# EAGLE board mt15_pla (EAGLE 6.6.0), part 1 of 4
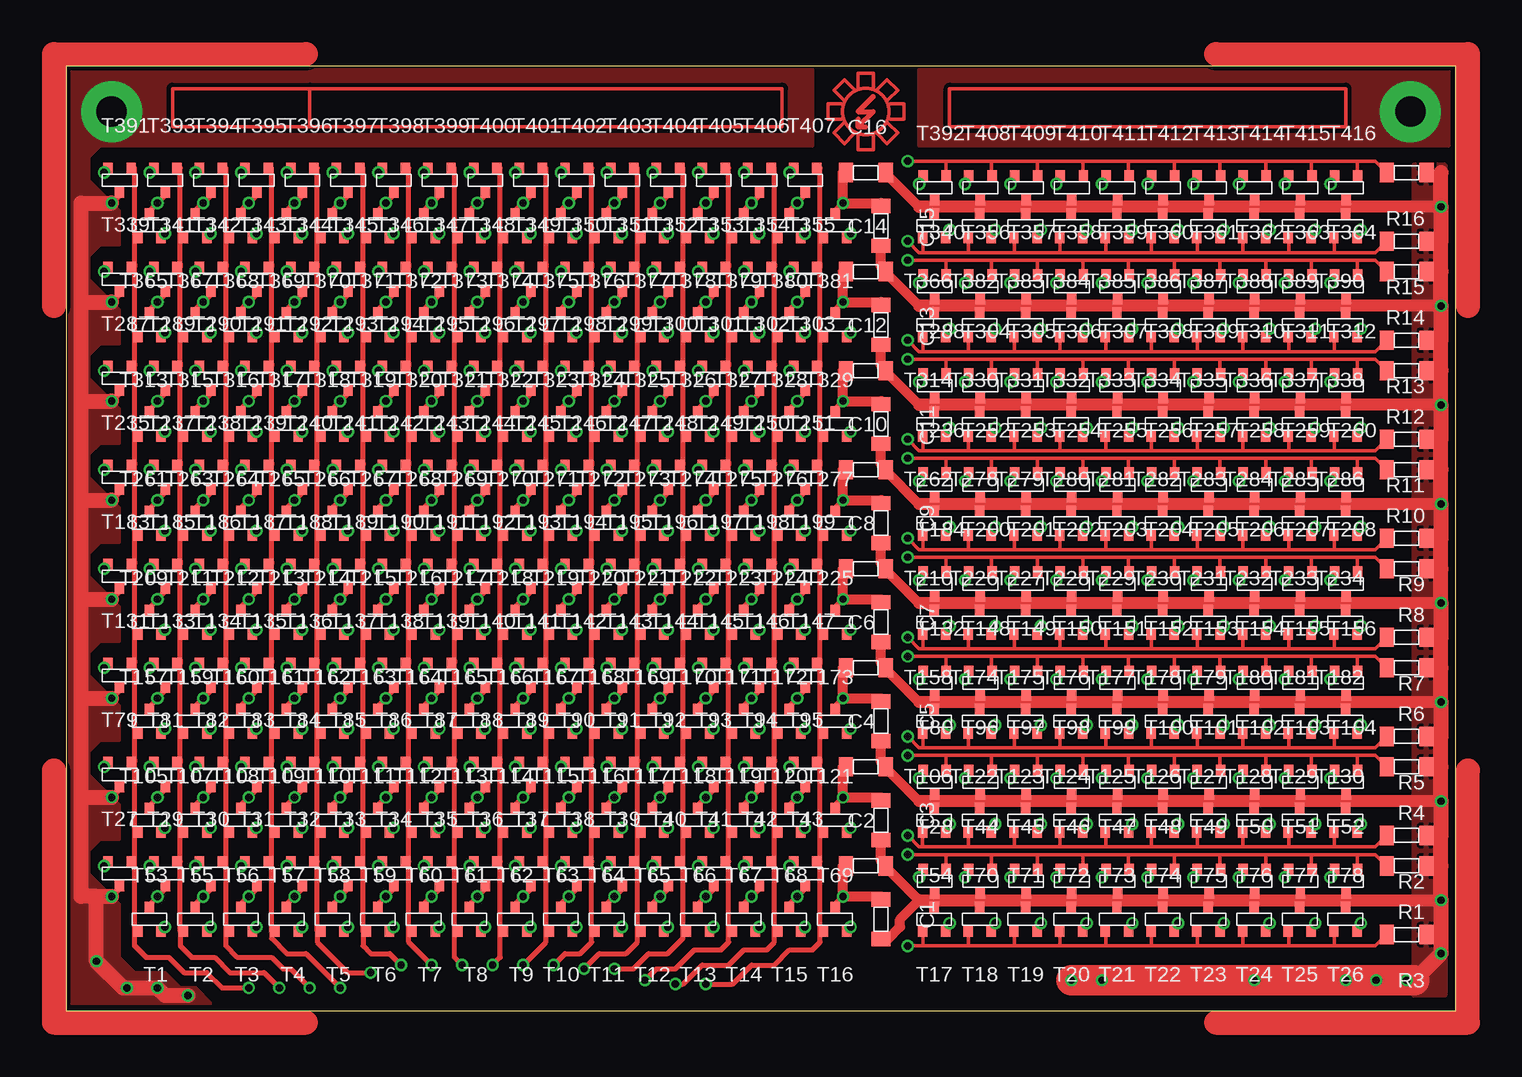
[diagram p9: board, top side]
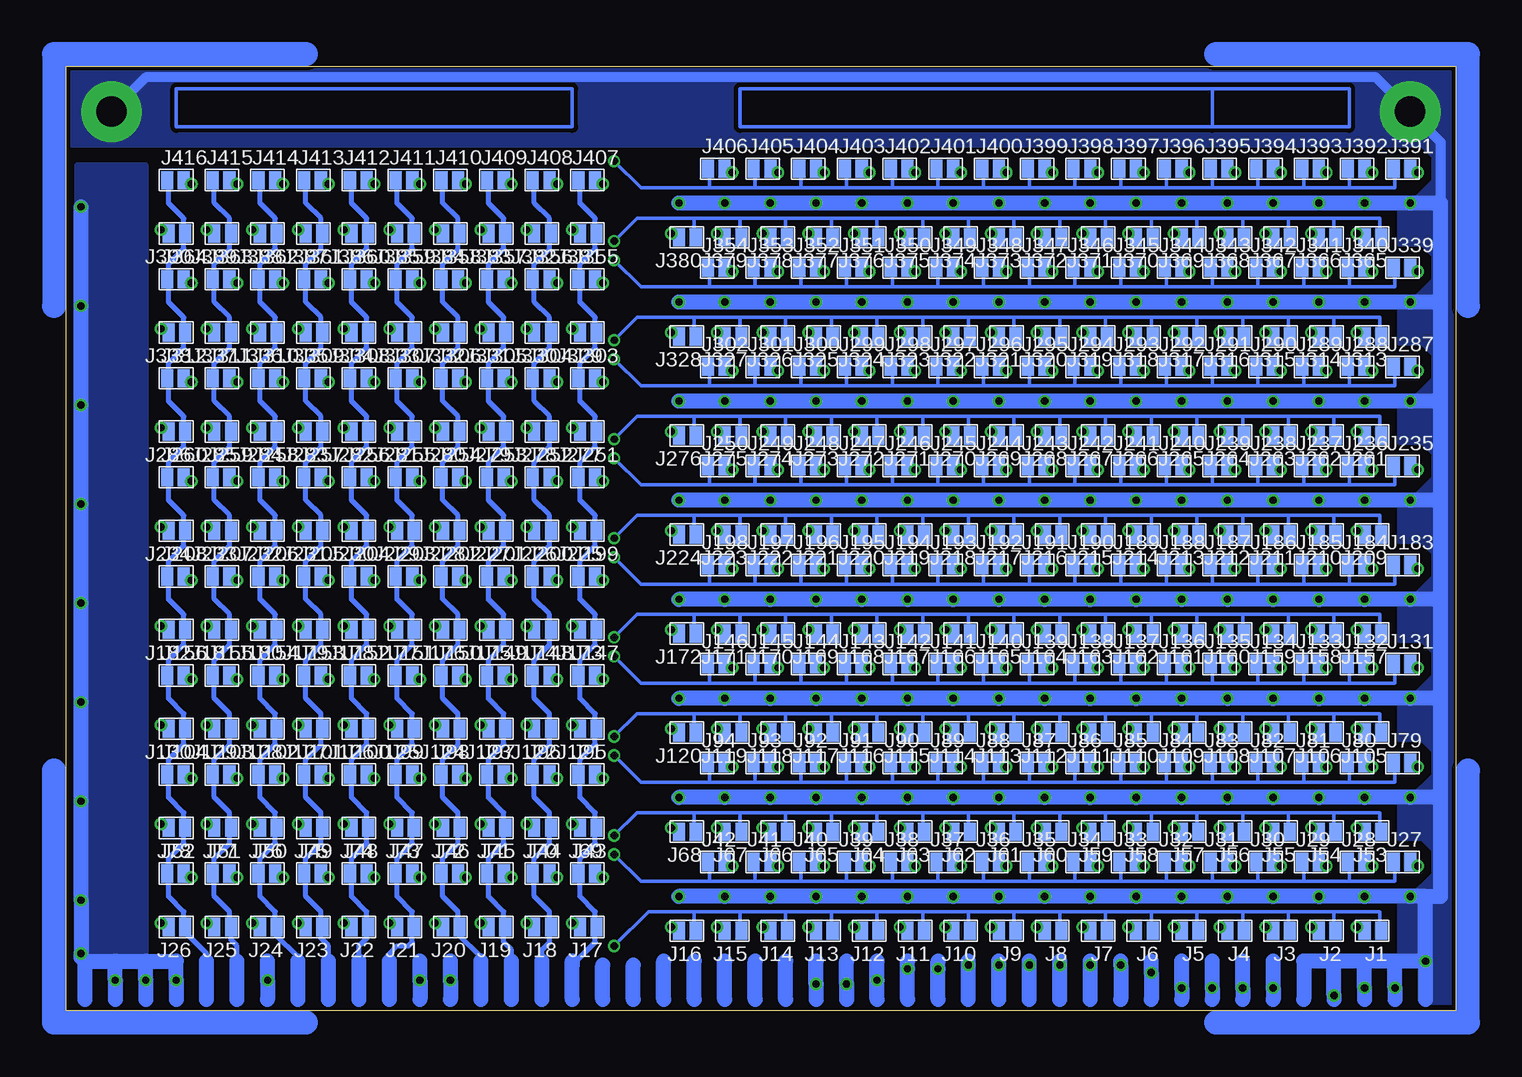
[diagram p10: board, bottom side, seen from below]

Size 115.87 x 78.73 mm. Coordinates in mm from the lower left corner, seen from the top.
Outline: 0,0 115.87,0 115.87,78.73 0,78.73 0,0
Copper layers (1*16): Top 0.035mm / dielectric 1.5mm / Bottom 0.035mm
Design rules "default *": minimum track width 10mil, minimum drill 0.6mm, track to track 8mil, track to pad 8mil, pad to pad 8mil, via to via 8mil, smd to smd 8mil, copper to edge 0mil, drill to drill 8mil, minimum pad ring 10mil, minimum via ring 8mil, stop-mask expansion 4mil, vias tented up to drill 0mil, thermal gap 10mil

## Footprints (pad centres in the part's own frame; a part is rotated, then mirrored left to right if it is on the bottom)
0204 = smd 1.194 x 1.6: 1 -1.651,0; 2 1.651,0
JUMPII = smd 1.016 x 1.524: 1 -0.762,0; 2 0.635,0
SOT-23 = smd 0.787 x 0.889: 1 -0.94,1.016; 2 0.991,1.016; 3 0.025,-1.016

## Placement (x,y rotation side)
C1  100n  [0204]  67.94,7.62 270 top
C2  100n  [0204]  66.67,12.06 0 top
C3  100n  [0204]  67.94,15.88 270 top
C4  100n  [0204]  66.67,20.32 0 top
C5  100n  [0204]  67.94,24.13 270 top
C6  100n  [0204]  66.67,28.57 0 top
C7  100n  [0204]  67.94,32.38 270 top
C8  100n  [0204]  66.67,36.83 0 top
C9  100n  [0204]  67.94,40.64 270 top
C10  100n  [0204]  66.67,45.09 0 top
C11  100n  [0204]  67.94,48.9 270 top
C12  100n  [0204]  66.67,53.34 0 top
C13  100n  [0204]  67.94,57.15 270 top
C14  100n  [0204]  66.67,61.59 0 top
C15  100n  [0204]  67.94,65.41 270 top
C16  100n  [0204]  66.67,69.85 0 top
J1  JUMPII  [JUMPII]  6.99,6.67 180 bottom
J2  JUMPII  [JUMPII]  10.79,6.67 180 bottom
J3  JUMPII  [JUMPII]  14.61,6.67 180 bottom
J4  JUMPII  [JUMPII]  18.41,6.67 180 bottom
J5  JUMPII  [JUMPII]  22.23,6.67 180 bottom
J6  JUMPII  [JUMPII]  26.04,6.67 180 bottom
J7  JUMPII  [JUMPII]  29.84,6.67 180 bottom
J8  JUMPII  [JUMPII]  33.66,6.67 180 bottom
J9  JUMPII  [JUMPII]  37.47,6.67 180 bottom
J10  JUMPII  [JUMPII]  41.27,6.67 180 bottom
J11  JUMPII  [JUMPII]  45.09,6.67 180 bottom
J12  JUMPII  [JUMPII]  48.9,6.67 180 bottom
J13  JUMPII  [JUMPII]  52.7,6.67 180 bottom
J14  JUMPII  [JUMPII]  56.52,6.67 180 bottom
J15  JUMPII  [JUMPII]  60.33,6.67 180 bottom
J16  JUMPII  [JUMPII]  64.14,6.67 180 bottom
J17  JUMPII  [JUMPII]  72.39,6.99 180 bottom
J18  JUMPII  [JUMPII]  76.2,6.99 180 bottom
J19  JUMPII  [JUMPII]  80.01,6.99 180 bottom
J20  JUMPII  [JUMPII]  83.82,6.99 180 bottom
J21  JUMPII  [JUMPII]  87.63,6.99 180 bottom
J22  JUMPII  [JUMPII]  91.44,6.99 180 bottom
J23  JUMPII  [JUMPII]  95.25,6.99 180 bottom
J24  JUMPII  [JUMPII]  99.06,6.99 180 bottom
J25  JUMPII  [JUMPII]  102.87,6.99 180 bottom
J26  JUMPII  [JUMPII]  106.68,6.99 180 bottom
J27  JUMPII  [JUMPII]  4.45,12.38 0 bottom
J28  JUMPII  [JUMPII]  8.26,12.38 0 bottom
J29  JUMPII  [JUMPII]  12.06,12.38 0 bottom
J30  JUMPII  [JUMPII]  15.88,12.38 0 bottom
J31  JUMPII  [JUMPII]  19.68,12.38 0 bottom
J32  JUMPII  [JUMPII]  23.5,12.38 0 bottom
J33  JUMPII  [JUMPII]  27.3,12.38 0 bottom
J34  JUMPII  [JUMPII]  31.11,12.38 0 bottom
J35  JUMPII  [JUMPII]  34.92,12.38 0 bottom
J36  JUMPII  [JUMPII]  38.73,12.38 0 bottom
J37  JUMPII  [JUMPII]  42.55,12.38 0 bottom
J38  JUMPII  [JUMPII]  46.35,12.38 0 bottom
J39  JUMPII  [JUMPII]  50.16,12.38 0 bottom
J40  JUMPII  [JUMPII]  53.98,12.38 0 bottom
J41  JUMPII  [JUMPII]  57.78,12.38 0 bottom
J42  JUMPII  [JUMPII]  61.59,12.38 0 bottom
J43  JUMPII  [JUMPII]  72.39,11.43 0 bottom
J44  JUMPII  [JUMPII]  76.2,11.43 0 bottom
J45  JUMPII  [JUMPII]  80.01,11.43 0 bottom
J46  JUMPII  [JUMPII]  83.82,11.43 0 bottom
J47  JUMPII  [JUMPII]  87.63,11.43 0 bottom
J48  JUMPII  [JUMPII]  91.44,11.43 0 bottom
J49  JUMPII  [JUMPII]  95.25,11.43 0 bottom
J50  JUMPII  [JUMPII]  99.06,11.43 0 bottom
J51  JUMPII  [JUMPII]  102.87,11.43 0 bottom
J52  JUMPII  [JUMPII]  106.68,11.43 0 bottom
J53  JUMPII  [JUMPII]  6.99,14.92 180 bottom
J54  JUMPII  [JUMPII]  10.79,14.92 180 bottom
J55  JUMPII  [JUMPII]  14.61,14.92 180 bottom
J56  JUMPII  [JUMPII]  18.41,14.92 180 bottom
J57  JUMPII  [JUMPII]  22.23,14.92 180 bottom
J58  JUMPII  [JUMPII]  26.04,14.92 180 bottom
J59  JUMPII  [JUMPII]  29.84,14.92 180 bottom
J60  JUMPII  [JUMPII]  33.66,14.92 180 bottom
J61  JUMPII  [JUMPII]  37.47,14.92 180 bottom
J62  JUMPII  [JUMPII]  41.27,14.92 180 bottom
J63  JUMPII  [JUMPII]  45.09,14.92 180 bottom
J64  JUMPII  [JUMPII]  48.9,14.92 180 bottom
J65  JUMPII  [JUMPII]  52.7,14.92 180 bottom
J66  JUMPII  [JUMPII]  56.52,14.92 180 bottom
J67  JUMPII  [JUMPII]  60.33,14.92 180 bottom
J68  JUMPII  [JUMPII]  64.14,14.92 180 bottom
J69  JUMPII  [JUMPII]  72.39,15.24 180 bottom
J70  JUMPII  [JUMPII]  76.2,15.24 180 bottom
J71  JUMPII  [JUMPII]  80.01,15.24 180 bottom
J72  JUMPII  [JUMPII]  83.82,15.24 180 bottom
J73  JUMPII  [JUMPII]  87.63,15.24 180 bottom
J74  JUMPII  [JUMPII]  91.44,15.24 180 bottom
J75  JUMPII  [JUMPII]  95.25,15.24 180 bottom
J76  JUMPII  [JUMPII]  99.06,15.24 180 bottom
J77  JUMPII  [JUMPII]  102.87,15.24 180 bottom
J78  JUMPII  [JUMPII]  106.68,15.24 180 bottom
J79  JUMPII  [JUMPII]  4.45,20.64 0 bottom
J80  JUMPII  [JUMPII]  8.26,20.64 0 bottom
J81  JUMPII  [JUMPII]  12.06,20.64 0 bottom
J82  JUMPII  [JUMPII]  15.88,20.64 0 bottom
J83  JUMPII  [JUMPII]  19.68,20.64 0 bottom
J84  JUMPII  [JUMPII]  23.5,20.64 0 bottom
J85  JUMPII  [JUMPII]  27.3,20.64 0 bottom
J86  JUMPII  [JUMPII]  31.11,20.64 0 bottom
J87  JUMPII  [JUMPII]  34.92,20.64 0 bottom
J88  JUMPII  [JUMPII]  38.73,20.64 0 bottom
J89  JUMPII  [JUMPII]  42.55,20.64 0 bottom
J90  JUMPII  [JUMPII]  46.35,20.64 0 bottom
J91  JUMPII  [JUMPII]  50.16,20.64 0 bottom
J92  JUMPII  [JUMPII]  53.98,20.64 0 bottom
J93  JUMPII  [JUMPII]  57.78,20.64 0 bottom
J94  JUMPII  [JUMPII]  61.59,20.64 0 bottom
J95  JUMPII  [JUMPII]  72.39,19.68 0 bottom
J96  JUMPII  [JUMPII]  76.2,19.68 0 bottom
J97  JUMPII  [JUMPII]  80.01,19.68 0 bottom
J98  JUMPII  [JUMPII]  83.82,19.68 0 bottom
J99  JUMPII  [JUMPII]  87.63,19.68 0 bottom
J100  JUMPII  [JUMPII]  91.44,19.68 0 bottom
J101  JUMPII  [JUMPII]  95.25,19.68 0 bottom
J102  JUMPII  [JUMPII]  99.06,19.68 0 bottom
J103  JUMPII  [JUMPII]  102.87,19.68 0 bottom
J104  JUMPII  [JUMPII]  106.68,19.68 0 bottom
J105  JUMPII  [JUMPII]  6.99,23.18 180 bottom
J106  JUMPII  [JUMPII]  10.79,23.18 180 bottom
J107  JUMPII  [JUMPII]  14.61,23.18 180 bottom
J108  JUMPII  [JUMPII]  18.41,23.18 180 bottom
J109  JUMPII  [JUMPII]  22.23,23.18 180 bottom
J110  JUMPII  [JUMPII]  26.04,23.18 180 bottom
J111  JUMPII  [JUMPII]  29.84,23.18 180 bottom
J112  JUMPII  [JUMPII]  33.66,23.18 180 bottom
J113  JUMPII  [JUMPII]  37.47,23.18 180 bottom
J114  JUMPII  [JUMPII]  41.27,23.18 180 bottom
J115  JUMPII  [JUMPII]  45.09,23.18 180 bottom
J116  JUMPII  [JUMPII]  48.9,23.18 180 bottom
J117  JUMPII  [JUMPII]  52.7,23.18 180 bottom
J118  JUMPII  [JUMPII]  56.52,23.18 180 bottom
J119  JUMPII  [JUMPII]  60.33,23.18 180 bottom
J120  JUMPII  [JUMPII]  64.14,23.18 180 bottom
J121  JUMPII  [JUMPII]  72.39,23.5 180 bottom
J122  JUMPII  [JUMPII]  76.2,23.5 180 bottom
J123  JUMPII  [JUMPII]  80.01,23.5 180 bottom
J124  JUMPII  [JUMPII]  83.82,23.5 180 bottom
J125  JUMPII  [JUMPII]  87.63,23.5 180 bottom
J126  JUMPII  [JUMPII]  91.44,23.5 180 bottom
J127  JUMPII  [JUMPII]  95.25,23.5 180 bottom
J128  JUMPII  [JUMPII]  99.06,23.5 180 bottom
J129  JUMPII  [JUMPII]  102.87,23.5 180 bottom
J130  JUMPII  [JUMPII]  106.68,23.5 180 bottom
J131  JUMPII  [JUMPII]  4.45,28.89 0 bottom
J132  JUMPII  [JUMPII]  8.26,28.89 0 bottom
J133  JUMPII  [JUMPII]  12.06,28.89 0 bottom
J134  JUMPII  [JUMPII]  15.88,28.89 0 bottom
J135  JUMPII  [JUMPII]  19.68,28.89 0 bottom
J136  JUMPII  [JUMPII]  23.5,28.89 0 bottom
J137  JUMPII  [JUMPII]  27.3,28.89 0 bottom
J138  JUMPII  [JUMPII]  31.11,28.89 0 bottom
J139  JUMPII  [JUMPII]  34.92,28.89 0 bottom
J140  JUMPII  [JUMPII]  38.73,28.89 0 bottom
J141  JUMPII  [JUMPII]  42.55,28.89 0 bottom
J142  JUMPII  [JUMPII]  46.35,28.89 0 bottom
J143  JUMPII  [JUMPII]  50.16,28.89 0 bottom
J144  JUMPII  [JUMPII]  53.98,28.89 0 bottom
J145  JUMPII  [JUMPII]  57.78,28.89 0 bottom
J146  JUMPII  [JUMPII]  61.59,28.89 0 bottom
J147  JUMPII  [JUMPII]  72.39,27.94 0 bottom
J148  JUMPII  [JUMPII]  76.2,27.94 0 bottom
J149  JUMPII  [JUMPII]  80.01,27.94 0 bottom
J150  JUMPII  [JUMPII]  83.82,27.94 0 bottom
J151  JUMPII  [JUMPII]  87.63,27.94 0 bottom
J152  JUMPII  [JUMPII]  91.44,27.94 0 bottom
J153  JUMPII  [JUMPII]  95.25,27.94 0 bottom
J154  JUMPII  [JUMPII]  99.06,27.94 0 bottom
J155  JUMPII  [JUMPII]  102.87,27.94 0 bottom
J156  JUMPII  [JUMPII]  106.68,27.94 0 bottom
J157  JUMPII  [JUMPII]  6.99,31.43 180 bottom
J158  JUMPII  [JUMPII]  10.79,31.43 180 bottom
J159  JUMPII  [JUMPII]  14.61,31.43 180 bottom
J160  JUMPII  [JUMPII]  18.41,31.43 180 bottom
J161  JUMPII  [JUMPII]  22.23,31.43 180 bottom
J162  JUMPII  [JUMPII]  26.04,31.43 180 bottom
J163  JUMPII  [JUMPII]  29.84,31.43 180 bottom
J164  JUMPII  [JUMPII]  33.66,31.43 180 bottom
J165  JUMPII  [JUMPII]  37.47,31.43 180 bottom
J166  JUMPII  [JUMPII]  41.27,31.43 180 bottom
J167  JUMPII  [JUMPII]  45.09,31.43 180 bottom
J168  JUMPII  [JUMPII]  48.9,31.43 180 bottom
J169  JUMPII  [JUMPII]  52.7,31.43 180 bottom
J170  JUMPII  [JUMPII]  56.52,31.43 180 bottom
J171  JUMPII  [JUMPII]  60.33,31.43 180 bottom
J172  JUMPII  [JUMPII]  64.14,31.43 180 bottom
J173  JUMPII  [JUMPII]  72.39,31.75 180 bottom
J174  JUMPII  [JUMPII]  76.2,31.75 180 bottom
J175  JUMPII  [JUMPII]  80.01,31.75 180 bottom
J176  JUMPII  [JUMPII]  83.82,31.75 180 bottom
J177  JUMPII  [JUMPII]  87.63,31.75 180 bottom
J178  JUMPII  [JUMPII]  91.44,31.75 180 bottom
J179  JUMPII  [JUMPII]  95.25,31.75 180 bottom
J180  JUMPII  [JUMPII]  99.06,31.75 180 bottom
J181  JUMPII  [JUMPII]  102.87,31.75 180 bottom
J182  JUMPII  [JUMPII]  106.68,31.75 180 bottom
J183  JUMPII  [JUMPII]  4.45,37.15 0 bottom
J184  JUMPII  [JUMPII]  8.26,37.15 0 bottom
J185  JUMPII  [JUMPII]  12.06,37.15 0 bottom
J186  JUMPII  [JUMPII]  15.88,37.15 0 bottom
J187  JUMPII  [JUMPII]  19.68,37.15 0 bottom
J188  JUMPII  [JUMPII]  23.5,37.15 0 bottom
J189  JUMPII  [JUMPII]  27.3,37.15 0 bottom
J190  JUMPII  [JUMPII]  31.11,37.15 0 bottom
J191  JUMPII  [JUMPII]  34.92,37.15 0 bottom
J192  JUMPII  [JUMPII]  38.73,37.15 0 bottom
J193  JUMPII  [JUMPII]  42.55,37.15 0 bottom
J194  JUMPII  [JUMPII]  46.35,37.15 0 bottom
J195  JUMPII  [JUMPII]  50.16,37.15 0 bottom
J196  JUMPII  [JUMPII]  53.98,37.15 0 bottom
J197  JUMPII  [JUMPII]  57.78,37.15 0 bottom
J198  JUMPII  [JUMPII]  61.59,37.15 0 bottom
J199  JUMPII  [JUMPII]  72.39,36.2 0 bottom
J200  JUMPII  [JUMPII]  76.2,36.2 0 bottom
J201  JUMPII  [JUMPII]  80.01,36.2 0 bottom
J202  JUMPII  [JUMPII]  83.82,36.2 0 bottom
J203  JUMPII  [JUMPII]  87.63,36.2 0 bottom
J204  JUMPII  [JUMPII]  91.44,36.2 0 bottom
J205  JUMPII  [JUMPII]  95.25,36.2 0 bottom
J206  JUMPII  [JUMPII]  99.06,36.2 0 bottom
J207  JUMPII  [JUMPII]  102.87,36.2 0 bottom
J208  JUMPII  [JUMPII]  106.68,36.2 0 bottom
J209  JUMPII  [JUMPII]  6.99,39.69 180 bottom
J210  JUMPII  [JUMPII]  10.79,39.69 180 bottom
J211  JUMPII  [JUMPII]  14.61,39.69 180 bottom
J212  JUMPII  [JUMPII]  18.41,39.69 180 bottom
J213  JUMPII  [JUMPII]  22.23,39.69 180 bottom
J214  JUMPII  [JUMPII]  26.04,39.69 180 bottom
J215  JUMPII  [JUMPII]  29.84,39.69 180 bottom
J216  JUMPII  [JUMPII]  33.66,39.69 180 bottom
J217  JUMPII  [JUMPII]  37.47,39.69 180 bottom
J218  JUMPII  [JUMPII]  41.27,39.69 180 bottom
J219  JUMPII  [JUMPII]  45.09,39.69 180 bottom
J220  JUMPII  [JUMPII]  48.9,39.69 180 bottom
J221  JUMPII  [JUMPII]  52.7,39.69 180 bottom
J222  JUMPII  [JUMPII]  56.52,39.69 180 bottom
J223  JUMPII  [JUMPII]  60.33,39.69 180 bottom
J224  JUMPII  [JUMPII]  64.14,39.69 180 bottom
J225  JUMPII  [JUMPII]  72.39,40.01 180 bottom
J226  JUMPII  [JUMPII]  76.2,40.01 180 bottom
J227  JUMPII  [JUMPII]  80.01,40.01 180 bottom
J228  JUMPII  [JUMPII]  83.82,40.01 180 bottom
J229  JUMPII  [JUMPII]  87.63,40.01 180 bottom
J230  JUMPII  [JUMPII]  91.44,40.01 180 bottom
J231  JUMPII  [JUMPII]  95.25,40.01 180 bottom
J232  JUMPII  [JUMPII]  99.06,40.01 180 bottom
J233  JUMPII  [JUMPII]  102.87,40.01 180 bottom
J234  JUMPII  [JUMPII]  106.68,40.01 180 bottom
J235  JUMPII  [JUMPII]  4.45,45.4 0 bottom
J236  JUMPII  [JUMPII]  8.26,45.4 0 bottom
J237  JUMPII  [JUMPII]  12.06,45.4 0 bottom
J238  JUMPII  [JUMPII]  15.88,45.4 0 bottom
J239  JUMPII  [JUMPII]  19.68,45.4 0 bottom
J240  JUMPII  [JUMPII]  23.5,45.4 0 bottom
J241  JUMPII  [JUMPII]  27.3,45.4 0 bottom
J242  JUMPII  [JUMPII]  31.11,45.4 0 bottom
J243  JUMPII  [JUMPII]  34.92,45.4 0 bottom
J244  JUMPII  [JUMPII]  38.73,45.4 0 bottom
J245  JUMPII  [JUMPII]  42.55,45.4 0 bottom
J246  JUMPII  [JUMPII]  46.35,45.4 0 bottom
J247  JUMPII  [JUMPII]  50.16,45.4 0 bottom
J248  JUMPII  [JUMPII]  53.98,45.4 0 bottom
J249  JUMPII  [JUMPII]  57.78,45.4 0 bottom
J250  JUMPII  [JUMPII]  61.59,45.4 0 bottom
J251  JUMPII  [JUMPII]  72.39,44.45 0 bottom
J252  JUMPII  [JUMPII]  76.2,44.45 0 bottom
J253  JUMPII  [JUMPII]  80.01,44.45 0 bottom
J254  JUMPII  [JUMPII]  83.82,44.45 0 bottom
J255  JUMPII  [JUMPII]  87.63,44.45 0 bottom
J256  JUMPII  [JUMPII]  91.44,44.45 0 bottom
J257  JUMPII  [JUMPII]  95.25,44.45 0 bottom
J258  JUMPII  [JUMPII]  99.06,44.45 0 bottom
J259  JUMPII  [JUMPII]  102.87,44.45 0 bottom
J260  JUMPII  [JUMPII]  106.68,44.45 0 bottom
J261  JUMPII  [JUMPII]  6.99,47.94 180 bottom
J262  JUMPII  [JUMPII]  10.79,47.94 180 bottom
J263  JUMPII  [JUMPII]  14.61,47.94 180 bottom
J264  JUMPII  [JUMPII]  18.41,47.94 180 bottom
J265  JUMPII  [JUMPII]  22.23,47.94 180 bottom
J266  JUMPII  [JUMPII]  26.04,47.94 180 bottom
J267  JUMPII  [JUMPII]  29.84,47.94 180 bottom
J268  JUMPII  [JUMPII]  33.66,47.94 180 bottom
J269  JUMPII  [JUMPII]  37.47,47.94 180 bottom
J270  JUMPII  [JUMPII]  41.27,47.94 180 bottom
J271  JUMPII  [JUMPII]  45.09,47.94 180 bottom
J272  JUMPII  [JUMPII]  48.9,47.94 180 bottom
J273  JUMPII  [JUMPII]  52.7,47.94 180 bottom
J274  JUMPII  [JUMPII]  56.52,47.94 180 bottom
J275  JUMPII  [JUMPII]  60.33,47.94 180 bottom
J276  JUMPII  [JUMPII]  64.14,47.94 180 bottom
J277  JUMPII  [JUMPII]  72.39,48.26 180 bottom
J278  JUMPII  [JUMPII]  76.2,48.26 180 bottom
J279  JUMPII  [JUMPII]  80.01,48.26 180 bottom
J280  JUMPII  [JUMPII]  83.82,48.26 180 bottom
J281  JUMPII  [JUMPII]  87.63,48.26 180 bottom
J282  JUMPII  [JUMPII]  91.44,48.26 180 bottom
J283  JUMPII  [JUMPII]  95.25,48.26 180 bottom
J284  JUMPII  [JUMPII]  99.06,48.26 180 bottom
J285  JUMPII  [JUMPII]  102.87,48.26 180 bottom
J286  JUMPII  [JUMPII]  106.68,48.26 180 bottom
J287  JUMPII  [JUMPII]  4.45,53.66 0 bottom
J288  JUMPII  [JUMPII]  8.26,53.66 0 bottom
J289  JUMPII  [JUMPII]  12.06,53.66 0 bottom
J290  JUMPII  [JUMPII]  15.88,53.66 0 bottom
J291  JUMPII  [JUMPII]  19.68,53.66 0 bottom
J292  JUMPII  [JUMPII]  23.5,53.66 0 bottom
J293  JUMPII  [JUMPII]  27.3,53.66 0 bottom
J294  JUMPII  [JUMPII]  31.11,53.66 0 bottom
J295  JUMPII  [JUMPII]  34.92,53.66 0 bottom
J296  JUMPII  [JUMPII]  38.73,53.66 0 bottom
J297  JUMPII  [JUMPII]  42.55,53.66 0 bottom
J298  JUMPII  [JUMPII]  46.35,53.66 0 bottom
J299  JUMPII  [JUMPII]  50.16,53.66 0 bottom
J300  JUMPII  [JUMPII]  53.98,53.66 0 bottom
J301  JUMPII  [JUMPII]  57.78,53.66 0 bottom
J302  JUMPII  [JUMPII]  61.59,53.66 0 bottom
J303  JUMPII  [JUMPII]  72.39,52.7 0 bottom
J304  JUMPII  [JUMPII]  76.2,52.7 0 bottom
J305  JUMPII  [JUMPII]  80.01,52.7 0 bottom
J306  JUMPII  [JUMPII]  83.82,52.7 0 bottom
J307  JUMPII  [JUMPII]  87.63,52.7 0 bottom
J308  JUMPII  [JUMPII]  91.44,52.7 0 bottom
J309  JUMPII  [JUMPII]  95.25,52.7 0 bottom
J310  JUMPII  [JUMPII]  99.06,52.7 0 bottom
J311  JUMPII  [JUMPII]  102.87,52.7 0 bottom
J312  JUMPII  [JUMPII]  106.68,52.7 0 bottom
J313  JUMPII  [JUMPII]  6.99,56.2 180 bottom
J314  JUMPII  [JUMPII]  10.79,56.2 180 bottom
J315  JUMPII  [JUMPII]  14.61,56.2 180 bottom
J316  JUMPII  [JUMPII]  18.41,56.2 180 bottom
J317  JUMPII  [JUMPII]  22.23,56.2 180 bottom
J318  JUMPII  [JUMPII]  26.04,56.2 180 bottom
J319  JUMPII  [JUMPII]  29.84,56.2 180 bottom
J320  JUMPII  [JUMPII]  33.66,56.2 180 bottom
J321  JUMPII  [JUMPII]  37.47,56.2 180 bottom
J322  JUMPII  [JUMPII]  41.27,56.2 180 bottom
J323  JUMPII  [JUMPII]  45.09,56.2 180 bottom
J324  JUMPII  [JUMPII]  48.9,56.2 180 bottom
J325  JUMPII  [JUMPII]  52.7,56.2 180 bottom
J326  JUMPII  [JUMPII]  56.52,56.2 180 bottom
J327  JUMPII  [JUMPII]  60.33,56.2 180 bottom
J328  JUMPII  [JUMPII]  64.14,56.2 180 bottom
J329  JUMPII  [JUMPII]  72.39,56.52 180 bottom
J330  JUMPII  [JUMPII]  76.2,56.52 180 bottom
J331  JUMPII  [JUMPII]  80.01,56.52 180 bottom
J332  JUMPII  [JUMPII]  83.82,56.52 180 bottom
J333  JUMPII  [JUMPII]  87.63,56.52 180 bottom
J334  JUMPII  [JUMPII]  91.44,56.52 180 bottom
J335  JUMPII  [JUMPII]  95.25,56.52 180 bottom
J336  JUMPII  [JUMPII]  99.06,56.52 180 bottom
J337  JUMPII  [JUMPII]  102.87,56.52 180 bottom
J338  JUMPII  [JUMPII]  106.68,56.52 180 bottom
J339  JUMPII  [JUMPII]  4.45,61.91 0 bottom
J340  JUMPII  [JUMPII]  8.26,61.91 0 bottom
J341  JUMPII  [JUMPII]  12.06,61.91 0 bottom
J342  JUMPII  [JUMPII]  15.88,61.91 0 bottom
J343  JUMPII  [JUMPII]  19.68,61.91 0 bottom
J344  JUMPII  [JUMPII]  23.5,61.91 0 bottom
J345  JUMPII  [JUMPII]  27.3,61.91 0 bottom
J346  JUMPII  [JUMPII]  31.11,61.91 0 bottom
J347  JUMPII  [JUMPII]  34.92,61.91 0 bottom
J348  JUMPII  [JUMPII]  38.73,61.91 0 bottom
J349  JUMPII  [JUMPII]  42.55,61.91 0 bottom
J350  JUMPII  [JUMPII]  46.35,61.91 0 bottom
J351  JUMPII  [JUMPII]  50.16,61.91 0 bottom
J352  JUMPII  [JUMPII]  53.98,61.91 0 bottom
J353  JUMPII  [JUMPII]  57.78,61.91 0 bottom
J354  JUMPII  [JUMPII]  61.59,61.91 0 bottom
J355  JUMPII  [JUMPII]  72.39,60.96 0 bottom
J356  JUMPII  [JUMPII]  76.2,60.96 0 bottom
J357  JUMPII  [JUMPII]  80.01,60.96 0 bottom
J358  JUMPII  [JUMPII]  83.82,60.96 0 bottom
J359  JUMPII  [JUMPII]  87.63,60.96 0 bottom
J360  JUMPII  [JUMPII]  91.44,60.96 0 bottom
J361  JUMPII  [JUMPII]  95.25,60.96 0 bottom
J362  JUMPII  [JUMPII]  99.06,60.96 0 bottom
J363  JUMPII  [JUMPII]  102.87,60.96 0 bottom
J364  JUMPII  [JUMPII]  106.68,60.96 0 bottom
J365  JUMPII  [JUMPII]  6.99,64.45 180 bottom
J366  JUMPII  [JUMPII]  10.79,64.45 180 bottom
J367  JUMPII  [JUMPII]  14.61,64.45 180 bottom
J368  JUMPII  [JUMPII]  18.41,64.45 180 bottom
J369  JUMPII  [JUMPII]  22.23,64.45 180 bottom
J370  JUMPII  [JUMPII]  26.04,64.45 180 bottom
J371  JUMPII  [JUMPII]  29.84,64.45 180 bottom
J372  JUMPII  [JUMPII]  33.66,64.45 180 bottom
J373  JUMPII  [JUMPII]  37.47,64.45 180 bottom
J374  JUMPII  [JUMPII]  41.27,64.45 180 bottom
J375  JUMPII  [JUMPII]  45.09,64.45 180 bottom
J376  JUMPII  [JUMPII]  48.9,64.45 180 bottom
J377  JUMPII  [JUMPII]  52.7,64.45 180 bottom
J378  JUMPII  [JUMPII]  56.52,64.45 180 bottom
J379  JUMPII  [JUMPII]  60.33,64.45 180 bottom
J380  JUMPII  [JUMPII]  64.14,64.45 180 bottom
J381  JUMPII  [JUMPII]  72.39,64.77 180 bottom
J382  JUMPII  [JUMPII]  76.2,64.77 180 bottom
J383  JUMPII  [JUMPII]  80.01,64.77 180 bottom
J384  JUMPII  [JUMPII]  83.82,64.77 180 bottom
J385  JUMPII  [JUMPII]  87.63,64.77 180 bottom
J386  JUMPII  [JUMPII]  91.44,64.77 180 bottom
J387  JUMPII  [JUMPII]  95.25,64.77 180 bottom
J388  JUMPII  [JUMPII]  99.06,64.77 180 bottom
J389  JUMPII  [JUMPII]  102.87,64.77 180 bottom
J390  JUMPII  [JUMPII]  106.68,64.77 180 bottom
J391  JUMPII  [JUMPII]  4.45,70.17 0 bottom
J392  JUMPII  [JUMPII]  8.26,70.17 0 bottom
J393  JUMPII  [JUMPII]  12.06,70.17 0 bottom
J394  JUMPII  [JUMPII]  15.88,70.17 0 bottom
J395  JUMPII  [JUMPII]  19.68,70.17 0 bottom
J396  JUMPII  [JUMPII]  23.5,70.17 0 bottom
J397  JUMPII  [JUMPII]  27.3,70.17 0 bottom
J398  JUMPII  [JUMPII]  31.11,70.17 0 bottom
J399  JUMPII  [JUMPII]  34.92,70.17 0 bottom
J400  JUMPII  [JUMPII]  38.73,70.17 0 bottom
J401  JUMPII  [JUMPII]  42.55,70.17 0 bottom
J402  JUMPII  [JUMPII]  46.35,70.17 0 bottom
J403  JUMPII  [JUMPII]  50.16,70.17 0 bottom
J404  JUMPII  [JUMPII]  53.98,70.17 0 bottom
J405  JUMPII  [JUMPII]  57.78,70.17 0 bottom
J406  JUMPII  [JUMPII]  61.59,70.17 0 bottom
J407  JUMPII  [JUMPII]  72.39,69.22 0 bottom
J408  JUMPII  [JUMPII]  76.2,69.22 0 bottom
J409  JUMPII  [JUMPII]  80.01,69.22 0 bottom
J410  JUMPII  [JUMPII]  83.82,69.22 0 bottom
J411  JUMPII  [JUMPII]  87.63,69.22 0 bottom
J412  JUMPII  [JUMPII]  91.44,69.22 0 bottom
J413  JUMPII  [JUMPII]  95.25,69.22 0 bottom
J414  JUMPII  [JUMPII]  99.06,69.22 0 bottom
J415  JUMPII  [JUMPII]  102.87,69.22 0 bottom
J416  JUMPII  [JUMPII]  106.68,69.22 0 bottom
R1  390  [0204]  111.76,12.06 180 top
R2  390  [0204]  111.76,14.61 180 top
R3  390  [0204]  111.76,6.35 180 top
R4  390  [0204]  111.76,20.32 180 top
R5  390  [0204]  111.76,22.86 180 top
R6  390  [0204]  111.76,28.57 180 top
R7  390  [0204]  111.76,31.11 180 top
R8  390  [0204]  111.76,36.83 180 top
R9  390  [0204]  111.76,39.37 180 top
R10  390  [0204]  111.76,45.09 180 top
R11  390  [0204]  111.76,47.62 180 top
R12  390  [0204]  111.76,53.34 180 top
R13  390  [0204]  111.76,55.88 180 top
R14  390  [0204]  111.76,61.59 180 top
R15  390  [0204]  111.76,64.14 180 top
R16  390  [0204]  111.76,69.85 180 top
T1  BC857  [SOT-23]  6.99,7.62 180 top
T2  BC857  [SOT-23]  10.79,7.62 180 top
T3  BC857  [SOT-23]  14.61,7.62 180 top
T4  BC857  [SOT-23]  18.41,7.62 180 top
T5  BC857  [SOT-23]  22.23,7.62 180 top
T6  BC857  [SOT-23]  26.04,7.62 180 top
T7  BC857  [SOT-23]  29.84,7.62 180 top
T8  BC857  [SOT-23]  33.66,7.62 180 top
T9  BC857  [SOT-23]  37.47,7.62 180 top
T10  BC857  [SOT-23]  41.27,7.62 180 top
T11  BC857  [SOT-23]  45.09,7.62 180 top
T12  BC857  [SOT-23]  48.9,7.62 180 top
T13  BC857  [SOT-23]  52.7,7.62 180 top
T14  BC857  [SOT-23]  56.52,7.62 180 top
T15  BC857  [SOT-23]  60.33,7.62 180 top
T16  BC857  [SOT-23]  64.14,7.62 180 top
T17  BC847  [SOT-23]  72.39,7.62 180 top
T18  BC847  [SOT-23]  76.2,7.62 180 top
T19  BC847  [SOT-23]  80.01,7.62 180 top
T20  BC847  [SOT-23]  83.82,7.62 180 top
T21  BC847  [SOT-23]  87.63,7.62 180 top
T22  BC847  [SOT-23]  91.44,7.62 180 top
T23  BC847  [SOT-23]  95.25,7.62 180 top
T24  BC847  [SOT-23]  99.06,7.62 180 top
T25  BC847  [SOT-23]  102.87,7.62 180 top
T26  BC847  [SOT-23]  106.68,7.62 180 top
T27  BC857  [SOT-23]  4.45,11.43 0 top
T28  BC847  [SOT-23]  72.39,10.79 0 top
T29  BC857  [SOT-23]  8.26,11.43 0 top
T30  BC857  [SOT-23]  12.06,11.43 0 top
T31  BC857  [SOT-23]  15.88,11.43 0 top
T32  BC857  [SOT-23]  19.68,11.43 0 top
T33  BC857  [SOT-23]  23.5,11.43 0 top
T34  BC857  [SOT-23]  27.3,11.43 0 top
T35  BC857  [SOT-23]  31.11,11.43 0 top
T36  BC857  [SOT-23]  34.92,11.43 0 top
T37  BC857  [SOT-23]  38.73,11.43 0 top
T38  BC857  [SOT-23]  42.55,11.43 0 top
T39  BC857  [SOT-23]  46.35,11.43 0 top
T40  BC857  [SOT-23]  50.16,11.43 0 top
T41  BC857  [SOT-23]  53.98,11.43 0 top
T42  BC857  [SOT-23]  57.78,11.43 0 top
T43  BC857  [SOT-23]  61.59,11.43 0 top
T44  BC847  [SOT-23]  76.2,10.79 0 top
T45  BC847  [SOT-23]  80.01,10.79 0 top
T46  BC847  [SOT-23]  83.82,10.79 0 top
T47  BC847  [SOT-23]  87.63,10.79 0 top
T48  BC847  [SOT-23]  91.44,10.79 0 top
T49  BC847  [SOT-23]  95.25,10.79 0 top
T50  BC847  [SOT-23]  99.06,10.79 0 top
T51  BC847  [SOT-23]  102.87,10.79 0 top
T52  BC847  [SOT-23]  106.68,10.79 0 top
T53  BC857  [SOT-23]  6.99,15.88 180 top
T54  BC847  [SOT-23]  72.39,15.88 180 top
T55  BC857  [SOT-23]  10.79,15.88 180 top
T56  BC857  [SOT-23]  14.61,15.88 180 top
T57  BC857  [SOT-23]  18.41,15.88 180 top
T58  BC857  [SOT-23]  22.23,15.88 180 top
T59  BC857  [SOT-23]  26.04,15.88 180 top
T60  BC857  [SOT-23]  29.84,15.88 180 top
T61  BC857  [SOT-23]  33.66,15.88 180 top
T62  BC857  [SOT-23]  37.47,15.88 180 top
T63  BC857  [SOT-23]  41.27,15.88 180 top
T64  BC857  [SOT-23]  45.09,15.88 180 top
T65  BC857  [SOT-23]  48.9,15.88 180 top
T66  BC857  [SOT-23]  52.7,15.88 180 top
T67  BC857  [SOT-23]  56.52,15.88 180 top
T68  BC857  [SOT-23]  60.33,15.88 180 top
T69  BC857  [SOT-23]  64.14,15.88 180 top
T70  BC847  [SOT-23]  76.2,15.88 180 top
T71  BC847  [SOT-23]  80.01,15.88 180 top
T72  BC847  [SOT-23]  83.82,15.88 180 top
T73  BC847  [SOT-23]  87.63,15.88 180 top
T74  BC847  [SOT-23]  91.44,15.88 180 top
T75  BC847  [SOT-23]  95.25,15.88 180 top
T76  BC847  [SOT-23]  99.06,15.88 180 top
T77  BC847  [SOT-23]  102.87,15.88 180 top
T78  BC847  [SOT-23]  106.68,15.88 180 top
T79  BC857  [SOT-23]  4.45,19.68 0 top
T80  BC847  [SOT-23]  72.39,19.05 0 top
T81  BC857  [SOT-23]  8.26,19.68 0 top
T82  BC857  [SOT-23]  12.06,19.68 0 top
T83  BC857  [SOT-23]  15.88,19.68 0 top
T84  BC857  [SOT-23]  19.68,19.68 0 top
T85  BC857  [SOT-23]  23.5,19.68 0 top
T86  BC857  [SOT-23]  27.3,19.68 0 top
T87  BC857  [SOT-23]  31.11,19.68 0 top
T88  BC857  [SOT-23]  34.92,19.68 0 top
T89  BC857  [SOT-23]  38.73,19.68 0 top
T90  BC857  [SOT-23]  42.55,19.68 0 top
T91  BC857  [SOT-23]  46.35,19.68 0 top
T92  BC857  [SOT-23]  50.16,19.68 0 top
T93  BC857  [SOT-23]  53.98,19.68 0 top
T94  BC857  [SOT-23]  57.78,19.68 0 top
T95  BC857  [SOT-23]  61.59,19.68 0 top
T96  BC847  [SOT-23]  76.2,19.05 0 top
T97  BC847  [SOT-23]  80.01,19.05 0 top
T98  BC847  [SOT-23]  83.82,19.05 0 top
T99  BC847  [SOT-23]  87.63,19.05 0 top
T100  BC847  [SOT-23]  91.44,19.05 0 top
T101  BC847  [SOT-23]  95.25,19.05 0 top
T102  BC847  [SOT-23]  99.06,19.05 0 top
T103  BC847  [SOT-23]  102.87,19.05 0 top
T104  BC847  [SOT-23]  106.68,19.05 0 top
T105  BC857  [SOT-23]  6.99,24.13 180 top
T106  BC847  [SOT-23]  72.39,24.13 180 top
T107  BC857  [SOT-23]  10.79,24.13 180 top
T108  BC857  [SOT-23]  14.61,24.13 180 top
T109  BC857  [SOT-23]  18.41,24.13 180 top
T110  BC857  [SOT-23]  22.23,24.13 180 top
T111  BC857  [SOT-23]  26.04,24.13 180 top
T112  BC857  [SOT-23]  29.84,24.13 180 top
T113  BC857  [SOT-23]  33.66,24.13 180 top
T114  BC857  [SOT-23]  37.47,24.13 180 top
T115  BC857  [SOT-23]  41.27,24.13 180 top
T116  BC857  [SOT-23]  45.09,24.13 180 top
T117  BC857  [SOT-23]  48.9,24.13 180 top
T118  BC857  [SOT-23]  52.7,24.13 180 top
T119  BC857  [SOT-23]  56.52,24.13 180 top
T120  BC857  [SOT-23]  60.33,24.13 180 top
T121  BC857  [SOT-23]  64.14,24.13 180 top
T122  BC847  [SOT-23]  76.2,24.13 180 top
T123  BC847  [SOT-23]  80.01,24.13 180 top
T124  BC847  [SOT-23]  83.82,24.13 180 top
T125  BC847  [SOT-23]  87.63,24.13 180 top
T126  BC847  [SOT-23]  91.44,24.13 180 top
T127  BC847  [SOT-23]  95.25,24.13 180 top
T128  BC847  [SOT-23]  99.06,24.13 180 top
T129  BC847  [SOT-23]  102.87,24.13 180 top
T130  BC847  [SOT-23]  106.68,24.13 180 top
T131  BC857  [SOT-23]  4.45,27.94 0 top
T132  BC847  [SOT-23]  72.39,27.3 0 top
T133  BC857  [SOT-23]  8.26,27.94 0 top
T134  BC857  [SOT-23]  12.06,27.94 0 top
T135  BC857  [SOT-23]  15.88,27.94 0 top
T136  BC857  [SOT-23]  19.68,27.94 0 top
T137  BC857  [SOT-23]  23.5,27.94 0 top
T138  BC857  [SOT-23]  27.3,27.94 0 top
T139  BC857  [SOT-23]  31.11,27.94 0 top
T140  BC857  [SOT-23]  34.92,27.94 0 top
T141  BC857  [SOT-23]  38.73,27.94 0 top
T142  BC857  [SOT-23]  42.55,27.94 0 top
T143  BC857  [SOT-23]  46.35,27.94 0 top
T144  BC857  [SOT-23]  50.16,27.94 0 top
T145  BC857  [SOT-23]  53.98,27.94 0 top
T146  BC857  [SOT-23]  57.78,27.94 0 top
T147  BC857  [SOT-23]  61.59,27.94 0 top
T148  BC847  [SOT-23]  76.2,27.3 0 top
T149  BC847  [SOT-23]  80.01,27.3 0 top
T150  BC847  [SOT-23]  83.82,27.3 0 top
T151  BC847  [SOT-23]  87.63,27.3 0 top
T152  BC847  [SOT-23]  91.44,27.3 0 top
T153  BC847  [SOT-23]  95.25,27.3 0 top
T154  BC847  [SOT-23]  99.06,27.3 0 top
T155  BC847  [SOT-23]  102.87,27.3 0 top
T156  BC847  [SOT-23]  106.68,27.3 0 top
T157  BC857  [SOT-23]  6.99,32.38 180 top
T158  BC847  [SOT-23]  72.39,32.38 180 top
T159  BC857  [SOT-23]  10.79,32.38 180 top
T160  BC857  [SOT-23]  14.61,32.38 180 top
T161  BC857  [SOT-23]  18.41,32.38 180 top
T162  BC857  [SOT-23]  22.23,32.38 180 top
T163  BC857  [SOT-23]  26.04,32.38 180 top
T164  BC857  [SOT-23]  29.84,32.38 180 top
T165  BC857  [SOT-23]  33.66,32.38 180 top
T166  BC857  [SOT-23]  37.47,32.38 180 top
T167  BC857  [SOT-23]  41.27,32.38 180 top
T168  BC857  [SOT-23]  45.09,32.38 180 top
T169  BC857  [SOT-23]  48.9,32.38 180 top
T170  BC857  [SOT-23]  52.7,32.38 180 top
T171  BC857  [SOT-23]  56.52,32.38 180 top
T172  BC857  [SOT-23]  60.33,32.38 180 top
T173  BC857  [SOT-23]  64.14,32.38 180 top
T174  BC847  [SOT-23]  76.2,32.38 180 top
T175  BC847  [SOT-23]  80.01,32.38 180 top
T176  BC847  [SOT-23]  83.82,32.38 180 top
T177  BC847  [SOT-23]  87.63,32.38 180 top
T178  BC847  [SOT-23]  91.44,32.38 180 top
T179  BC847  [SOT-23]  95.25,32.38 180 top
T180  BC847  [SOT-23]  99.06,32.38 180 top
T181  BC847  [SOT-23]  102.87,32.38 180 top
T182  BC847  [SOT-23]  106.68,32.38 180 top
T183  BC857  [SOT-23]  4.45,36.2 0 top
T184  BC847  [SOT-23]  72.39,35.56 0 top
T185  BC857  [SOT-23]  8.26,36.2 0 top
T186  BC857  [SOT-23]  12.06,36.2 0 top
T187  BC857  [SOT-23]  15.88,36.2 0 top
T188  BC857  [SOT-23]  19.68,36.2 0 top
T189  BC857  [SOT-23]  23.5,36.2 0 top
T190  BC857  [SOT-23]  27.3,36.2 0 top
T191  BC857  [SOT-23]  31.11,36.2 0 top
T192  BC857  [SOT-23]  34.92,36.2 0 top
T193  BC857  [SOT-23]  38.73,36.2 0 top
T194  BC857  [SOT-23]  42.55,36.2 0 top
T195  BC857  [SOT-23]  46.35,36.2 0 top
T196  BC857  [SOT-23]  50.16,36.2 0 top
T197  BC857  [SOT-23]  53.98,36.2 0 top
T198  BC857  [SOT-23]  57.78,36.2 0 top
T199  BC857  [SOT-23]  61.59,36.2 0 top
T200  BC847  [SOT-23]  76.2,35.56 0 top
T201  BC847  [SOT-23]  80.01,35.56 0 top
T202  BC847  [SOT-23]  83.82,35.56 0 top
T203  BC847  [SOT-23]  87.63,35.56 0 top
T204  BC847  [SOT-23]  91.44,35.56 0 top
T205  BC847  [SOT-23]  95.25,35.56 0 top
T206  BC847  [SOT-23]  99.06,35.56 0 top
T207  BC847  [SOT-23]  102.87,35.56 0 top
T208  BC847  [SOT-23]  106.68,35.56 0 top
T209  BC857  [SOT-23]  6.99,40.64 180 top
T210  BC847  [SOT-23]  72.39,40.64 180 top
T211  BC857  [SOT-23]  10.79,40.64 180 top
T212  BC857  [SOT-23]  14.61,40.64 180 top
T213  BC857  [SOT-23]  18.41,40.64 180 top
T214  BC857  [SOT-23]  22.23,40.64 180 top
T215  BC857  [SOT-23]  26.04,40.64 180 top
T216  BC857  [SOT-23]  29.84,40.64 180 top
T217  BC857  [SOT-23]  33.66,40.64 180 top
T218  BC857  [SOT-23]  37.47,40.64 180 top
T219  BC857  [SOT-23]  41.27,40.64 180 top
T220  BC857  [SOT-23]  45.09,40.64 180 top
T221  BC857  [SOT-23]  48.9,40.64 180 top
T222  BC857  [SOT-23]  52.7,40.64 180 top
T223  BC857  [SOT-23]  56.52,40.64 180 top
T224  BC857  [SOT-23]  60.33,40.64 180 top
T225  BC857  [SOT-23]  64.14,40.64 180 top
T226  BC847  [SOT-23]  76.2,40.64 180 top
T227  BC847  [SOT-23]  80.01,40.64 180 top
T228  BC847  [SOT-23]  83.82,40.64 180 top
T229  BC847  [SOT-23]  87.63,40.64 180 top
T230  BC847  [SOT-23]  91.44,40.64 180 top
T231  BC847  [SOT-23]  95.25,40.64 180 top
T232  BC847  [SOT-23]  99.06,40.64 180 top
T233  BC847  [SOT-23]  102.87,40.64 180 top
T234  BC847  [SOT-23]  106.68,40.64 180 top
T235  BC857  [SOT-23]  4.45,44.45 0 top
T236  BC847  [SOT-23]  72.39,43.81 0 top
T237  BC857  [SOT-23]  8.26,44.45 0 top
T238  BC857  [SOT-23]  12.06,44.45 0 top
T239  BC857  [SOT-23]  15.88,44.45 0 top
T240  BC857  [SOT-23]  19.68,44.45 0 top
T241  BC857  [SOT-23]  23.5,44.45 0 top
T242  BC857  [SOT-23]  27.3,44.45 0 top
T243  BC857  [SOT-23]  31.11,44.45 0 top
T244  BC857  [SOT-23]  34.92,44.45 0 top
T245  BC857  [SOT-23]  38.73,44.45 0 top
T246  BC857  [SOT-23]  42.55,44.45 0 top
T247  BC857  [SOT-23]  46.35,44.45 0 top
T248  BC857  [SOT-23]  50.16,44.45 0 top
T249  BC857  [SOT-23]  53.98,44.45 0 top
T250  BC857  [SOT-23]  57.78,44.45 0 top
T251  BC857  [SOT-23]  61.59,44.45 0 top
T252  BC847  [SOT-23]  76.2,43.81 0 top
T253  BC847  [SOT-23]  80.01,43.81 0 top
T254  BC847  [SOT-23]  83.82,43.81 0 top
T255  BC847  [SOT-23]  87.63,43.81 0 top
T256  BC847  [SOT-23]  91.44,43.81 0 top
T257  BC847  [SOT-23]  95.25,43.81 0 top
T258  BC847  [SOT-23]  99.06,43.81 0 top
T259  BC847  [SOT-23]  102.87,43.81 0 top
T260  BC847  [SOT-23]  106.68,43.81 0 top
T261  BC857  [SOT-23]  6.99,48.9 180 top
T262  BC847  [SOT-23]  72.39,48.9 180 top
T263  BC857  [SOT-23]  10.79,48.9 180 top
T264  BC857  [SOT-23]  14.61,48.9 180 top
T265  BC857  [SOT-23]  18.41,48.9 180 top
T266  BC857  [SOT-23]  22.23,48.9 180 top
T267  BC857  [SOT-23]  26.04,48.9 180 top
T268  BC857  [SOT-23]  29.84,48.9 180 top
T269  BC857  [SOT-23]  33.66,48.9 180 top
T270  BC857  [SOT-23]  37.47,48.9 180 top
T271  BC857  [SOT-23]  41.27,48.9 180 top
T272  BC857  [SOT-23]  45.09,48.9 180 top
T273  BC857  [SOT-23]  48.9,48.9 180 top
T274  BC857  [SOT-23]  52.7,48.9 180 top
T275  BC857  [SOT-23]  56.52,48.9 180 top
T276  BC857  [SOT-23]  60.33,48.9 180 top
T277  BC857  [SOT-23]  64.14,48.9 180 top
T278  BC847  [SOT-23]  76.2,48.9 180 top
T279  BC847  [SOT-23]  80.01,48.9 180 top
T280  BC847  [SOT-23]  83.82,48.9 180 top
T281  BC847  [SOT-23]  87.63,48.9 180 top
T282  BC847  [SOT-23]  91.44,48.9 180 top
T283  BC847  [SOT-23]  95.25,48.9 180 top
T284  BC847  [SOT-23]  99.06,48.9 180 top
T285  BC847  [SOT-23]  102.87,48.9 180 top
T286  BC847  [SOT-23]  106.68,48.9 180 top
T287  BC857  [SOT-23]  4.45,52.7 0 top
T288  BC847  [SOT-23]  72.39,52.07 0 top
T289  BC857  [SOT-23]  8.26,52.7 0 top
T290  BC857  [SOT-23]  12.06,52.7 0 top
T291  BC857  [SOT-23]  15.88,52.7 0 top
T292  BC857  [SOT-23]  19.68,52.7 0 top
T293  BC857  [SOT-23]  23.5,52.7 0 top
T294  BC857  [SOT-23]  27.3,52.7 0 top
T295  BC857  [SOT-23]  31.11,52.7 0 top
T296  BC857  [SOT-23]  34.92,52.7 0 top
T297  BC857  [SOT-23]  38.73,52.7 0 top
T298  BC857  [SOT-23]  42.55,52.7 0 top
T299  BC857  [SOT-23]  46.35,52.7 0 top
T300  BC857  [SOT-23]  50.16,52.7 0 top
T301  BC857  [SOT-23]  53.98,52.7 0 top
T302  BC857  [SOT-23]  57.78,52.7 0 top
T303  BC857  [SOT-23]  61.59,52.7 0 top
T304  BC847  [SOT-23]  76.2,52.07 0 top
T305  BC847  [SOT-23]  80.01,52.07 0 top
T306  BC847  [SOT-23]  83.82,52.07 0 top
T307  BC847  [SOT-23]  87.63,52.07 0 top
T308  BC847  [SOT-23]  91.44,52.07 0 top
T309  BC847  [SOT-23]  95.25,52.07 0 top
T310  BC847  [SOT-23]  99.06,52.07 0 top
T311  BC847  [SOT-23]  102.87,52.07 0 top
T312  BC847  [SOT-23]  106.68,52.07 0 top
T313  BC857  [SOT-23]  6.99,57.15 180 top
T314  BC847  [SOT-23]  72.39,57.15 180 top
T315  BC857  [SOT-23]  10.79,57.15 180 top
T316  BC857  [SOT-23]  14.61,57.15 180 top
T317  BC857  [SOT-23]  18.41,57.15 180 top
T318  BC857  [SOT-23]  22.23,57.15 180 top
T319  BC857  [SOT-23]  26.04,57.15 180 top
T320  BC857  [SOT-23]  29.84,57.15 180 top
T321  BC857  [SOT-23]  33.66,57.15 180 top
T322  BC857  [SOT-23]  37.47,57.15 180 top
T323  BC857  [SOT-23]  41.27,57.15 180 top
T324  BC857  [SOT-23]  45.09,57.15 180 top
T325  BC857  [SOT-23]  48.9,57.15 180 top
T326  BC857  [SOT-23]  52.7,57.15 180 top
T327  BC857  [SOT-23]  56.52,57.15 180 top
T328  BC857  [SOT-23]  60.33,57.15 180 top
T329  BC857  [SOT-23]  64.14,57.15 180 top
T330  BC847  [SOT-23]  76.2,57.15 180 top
T331  BC847  [SOT-23]  80.01,57.15 180 top
T332  BC847  [SOT-23]  83.82,57.15 180 top
T333  BC847  [SOT-23]  87.63,57.15 180 top
T334  BC847  [SOT-23]  91.44,57.15 180 top
T335  BC847  [SOT-23]  95.25,57.15 180 top
T336  BC847  [SOT-23]  99.06,57.15 180 top
T337  BC847  [SOT-23]  102.87,57.15 180 top
T338  BC847  [SOT-23]  106.68,57.15 180 top
T339  BC857  [SOT-23]  4.45,60.96 0 top
T340  BC847  [SOT-23]  72.39,60.33 0 top
T341  BC857  [SOT-23]  8.26,60.96 0 top
T342  BC857  [SOT-23]  12.06,60.96 0 top
T343  BC857  [SOT-23]  15.88,60.96 0 top
T344  BC857  [SOT-23]  19.68,60.96 0 top
T345  BC857  [SOT-23]  23.5,60.96 0 top
T346  BC857  [SOT-23]  27.3,60.96 0 top
T347  BC857  [SOT-23]  31.11,60.96 0 top
T348  BC857  [SOT-23]  34.92,60.96 0 top
T349  BC857  [SOT-23]  38.73,60.96 0 top
T350  BC857  [SOT-23]  42.55,60.96 0 top
T351  BC857  [SOT-23]  46.35,60.96 0 top
T352  BC857  [SOT-23]  50.16,60.96 0 top
T353  BC857  [SOT-23]  53.98,60.96 0 top
T354  BC857  [SOT-23]  57.78,60.96 0 top
T355  BC857  [SOT-23]  61.59,60.96 0 top
T356  BC847  [SOT-23]  76.2,60.33 0 top
T357  BC847  [SOT-23]  80.01,60.33 0 top
T358  BC847  [SOT-23]  83.82,60.33 0 top
T359  BC847  [SOT-23]  87.63,60.33 0 top
T360  BC847  [SOT-23]  91.44,60.33 0 top
T361  BC847  [SOT-23]  95.25,60.33 0 top
T362  BC847  [SOT-23]  99.06,60.33 0 top
T363  BC847  [SOT-23]  102.87,60.33 0 top
T364  BC847  [SOT-23]  106.68,60.33 0 top
T365  BC857  [SOT-23]  6.99,65.41 180 top
T366  BC847  [SOT-23]  72.39,65.41 180 top
T367  BC857  [SOT-23]  10.79,65.41 180 top
T368  BC857  [SOT-23]  14.61,65.41 180 top
T369  BC857  [SOT-23]  18.41,65.41 180 top
T370  BC857  [SOT-23]  22.23,65.41 180 top
T371  BC857  [SOT-23]  26.04,65.41 180 top
T372  BC857  [SOT-23]  29.84,65.41 180 top
T373  BC857  [SOT-23]  33.66,65.41 180 top
T374  BC857  [SOT-23]  37.47,65.41 180 top
T375  BC857  [SOT-23]  41.27,65.41 180 top
T376  BC857  [SOT-23]  45.09,65.41 180 top
T377  BC857  [SOT-23]  48.9,65.41 180 top
T378  BC857  [SOT-23]  52.7,65.41 180 top
T379  BC857  [SOT-23]  56.52,65.41 180 top
T380  BC857  [SOT-23]  60.33,65.41 180 top
T381  BC857  [SOT-23]  64.14,65.41 180 top
T382  BC847  [SOT-23]  76.2,65.41 180 top
T383  BC847  [SOT-23]  80.01,65.41 180 top
T384  BC847  [SOT-23]  83.82,65.41 180 top
T385  BC847  [SOT-23]  87.63,65.41 180 top
T386  BC847  [SOT-23]  91.44,65.41 180 top
T387  BC847  [SOT-23]  95.25,65.41 180 top
T388  BC847  [SOT-23]  99.06,65.41 180 top
T389  BC847  [SOT-23]  102.87,65.41 180 top
T390  BC847  [SOT-23]  106.68,65.41 180 top
T391  BC857  [SOT-23]  4.45,69.22 0 top
T392  BC847  [SOT-23]  72.39,68.58 0 top
T393  BC857  [SOT-23]  8.26,69.22 0 top
T394  BC857  [SOT-23]  12.06,69.22 0 top
T395  BC857  [SOT-23]  15.88,69.22 0 top
T396  BC857  [SOT-23]  19.68,69.22 0 top
T397  BC857  [SOT-23]  23.5,69.22 0 top
T398  BC857  [SOT-23]  27.3,69.22 0 top
T399  BC857  [SOT-23]  31.11,69.22 0 top
T400  BC857  [SOT-23]  34.92,69.22 0 top
T401  BC857  [SOT-23]  38.73,69.22 0 top
T402  BC857  [SOT-23]  42.55,69.22 0 top
T403  BC857  [SOT-23]  46.35,69.22 0 top
T404  BC857  [SOT-23]  50.16,69.22 0 top
T405  BC857  [SOT-23]  53.98,69.22 0 top
T406  BC857  [SOT-23]  57.78,69.22 0 top
T407  BC857  [SOT-23]  61.59,69.22 0 top
T408  BC847  [SOT-23]  76.2,68.58 0 top
T409  BC847  [SOT-23]  80.01,68.58 0 top
T410  BC847  [SOT-23]  83.82,68.58 0 top
T411  BC847  [SOT-23]  87.63,68.58 0 top
T412  BC847  [SOT-23]  91.44,68.58 0 top
T413  BC847  [SOT-23]  95.25,68.58 0 top
T414  BC847  [SOT-23]  99.06,68.58 0 top
T415  BC847  [SOT-23]  102.87,68.58 0 top
T416  BC847  [SOT-23]  106.68,68.58 0 top
U$41  [T1]  66.67,74.93 0 top

## Tracks (layer width: path | path; a pad name or v marks a point on that pad's centre or on a via)
GND  (via drill 0.61 pad 1.02, 2.54 pad 5.08)
  Top 0.406: T4.3 18.41,8.66 18.41,8.89 v19.05,9.53 19.68,10.16 19.68,10.39 T32.3 | T5.3 22.23,8.66 22.23,8.89 v22.86,9.53 23.5,10.16 23.5,10.39 T33.3 | T6.3 26.04,8.66 26.04,8.89 v26.67,9.53 27.33,10.19 T34.3 | 15.88,10.39 T31.3 15.9,10.19 v15.24,9.53 14.58,8.87 T3.3 | T1.3 6.96,8.87 v7.62,9.53 8.28,10.19 T29.3 | T2.3 10.77,8.87 v11.43,9.53 12.09,10.19 T30.3 | T27.3 4.47,10.19 v3.81,9.53 | T16.3 64.11,8.87 v64.77,9.53 | T15.3 60.3,8.87 v60.96,9.53 61.62,10.19 T43.3 | T14.3 56.49,8.87 v57.15,9.53 57.81,10.19 T42.3 | T41.3 54,10.19 v53.34,9.53 52.68,8.87 T13.3 | T40.3 50.19,10.19 v49.53,9.53 48.87,8.87 T12.3 | T39.3 46.38,10.19 v45.72,9.53 45.06,8.87 T11.3 | T38.3 42.57,10.19 v41.91,9.53 41.25,8.87 T10.3 | T7.3 29.82,8.87 v30.48,9.53 31.14,10.19 T35.3 | T8.3 33.63,8.87 v34.29,9.53 34.95,10.19 T36.3 | T9.3 37.44,8.87 v38.1,9.53 38.76,10.19 T37.3 | T79.3 4.47,18.44 v3.81,17.78 | T81.3 8.28,18.44 v7.62,17.78 6.96,17.12 T53.3 | T55.3 10.77,17.12 v11.43,17.78 12.09,18.44 T82.3 | T56.3 14.58,17.12 v15.24,17.78 15.9,18.44 T83.3 | T57.3 18.39,17.12 v19.05,17.78 19.71,18.44 T84.3 | T58.3 22.2,17.12 v22.86,17.78 23.52,18.44 T85.3 | T59.3 26.01,17.12 v26.67,17.78 27.33,18.44 T86.3 | T60.3 29.82,17.12 v30.48,17.78 31.14,18.44 T87.3 | T61.3 33.63,17.12 v34.29,17.78 34.95,18.44 T88.3 | T62.3 37.44,17.12 v38.1,17.78 38.76,18.44 T89.3 | T63.3 41.25,17.12 v41.91,17.78 42.57,18.44 T90.3 | T64.3 45.06,17.12 v45.72,17.78 46.38,18.44 T91.3 | T65.3 48.87,17.12 v49.53,17.78 50.19,18.44 T92.3 | T66.3 52.68,17.12 v53.34,17.78 54,18.44 T93.3 | T67.3 56.49,17.12 v57.15,17.78 57.81,18.44 T94.3 | T68.3 60.3,17.12 v60.96,17.78 61.62,18.44 T95.3
  Top 0.406: T69.3 64.11,17.12 v64.77,17.78 | T131.3 4.47,26.7 v3.81,26.04 | T133.3 8.28,26.7 v7.62,26.04 6.96,25.38 T105.3 | T134.3 12.09,26.7 v11.43,26.04 10.77,25.38 T107.3 | T135.3 15.9,26.7 v15.24,26.04 14.58,25.38 T108.3 | T136.3 19.71,26.7 v19.05,26.04 18.39,25.38 T109.3 | T137.3 23.52,26.7 v22.86,26.04 22.2,25.38 T110.3 | T138.3 27.33,26.7 v26.67,26.04 26.01,25.38 T111.3 | T139.3 31.14,26.7 v30.48,26.04 29.82,25.38 T112.3 | T140.3 34.95,26.7 v34.29,26.04 33.63,25.38 T113.3 | T141.3 38.76,26.7 v38.1,26.04 37.44,25.38 T114.3 | T142.3 42.57,26.7 v41.91,26.04 41.25,25.38 T115.3 | T143.3 46.38,26.7 v45.72,26.04 45.06,25.38 T116.3 | T144.3 50.19,26.7 v49.53,26.04 48.87,25.38 T117.3 | T145.3 54,26.7 v53.34,26.04 52.68,25.38 T118.3 | T146.3 57.81,26.7 v57.15,26.04 56.49,25.38 T119.3 | T147.3 61.62,26.7 v60.96,26.04 60.3,25.38 T120.3 | T121.3 64.11,25.38 v64.77,26.04 | T183.3 4.47,34.95 v3.81,34.29 | T235.3 4.47,43.2 v3.81,42.55 | T287.3 4.47,51.46 v3.81,50.8 | T157.3 6.96,33.63 v7.62,34.29 8.28,34.95 T185.3 | T159.3 10.77,33.63 v11.43,34.29 12.09,34.95 T186.3 | T160.3 14.58,33.63 v15.24,34.29 15.9,34.95 T187.3 | T161.3 18.39,33.63 v19.05,34.29 19.71,34.95 T188.3 | T162.3 22.2,33.63 v22.86,34.29 23.52,34.95 T189.3 | T190.3 27.33,34.95 v26.67,34.29 26.01,33.63 T163.3 | T164.3 29.82,33.63 v30.48,34.29 31.14,34.95 T191.3 | T165.3 33.63,33.63 v34.29,34.29 34.95,34.95 T192.3 | T166.3 37.44,33.63 v38.1,34.29 38.76,34.95 T193.3 | T167.3 41.25,33.63 v41.91,34.29 42.57,34.95 T194.3 | T168.3 45.06,33.63 v45.72,34.29 46.38,34.95 T195.3 | T169.3 48.87,33.63 v49.53,34.29 50.19,34.95 T196.3 | T170.3 52.68,33.63 v53.34,34.29 54,34.95 T197.3
  Top 0.406: T171.3 56.49,33.63 v57.15,34.29 57.81,34.95 T198.3 | T172.3 60.3,33.63 v60.96,34.29 61.62,34.95 T199.3 | T173.3 64.11,33.63 v64.77,34.29 | T391.3 4.47,67.97 v3.81,67.31 | T339.3 4.47,59.72 v3.81,59.05 | T209.3 6.96,41.88 v7.62,42.55 8.28,43.2 T237.3 | T261.3 6.96,50.14 v7.62,50.8 8.28,51.46 T289.3 | T263.3 10.77,50.14 v11.43,50.8 12.09,51.46 T290.3 | T264.3 14.58,50.14 v15.24,50.8 15.9,51.46 T291.3 | T265.3 18.39,50.14 v19.05,50.8 19.71,51.46 T292.3 | T266.3 22.2,50.14 v22.86,50.8 23.52,51.46 T293.3 | T267.3 26.01,50.14 v26.67,50.8 27.33,51.46 T294.3 | T268.3 29.82,50.14 v30.48,50.8 31.14,51.46 T295.3 | T269.3 33.63,50.14 v34.29,50.8 34.95,51.46 T296.3 | T270.3 37.44,50.14 v38.1,50.8 38.76,51.46 T297.3 | T271.3 41.25,50.14 v41.91,50.8 42.57,51.46 T298.3 | T272.3 45.06,50.14 v45.72,50.8 46.38,51.46 T299.3 | T273.3 48.87,50.14 v49.53,50.8 50.19,51.46 T300.3 | T274.3 52.68,50.14 v53.34,50.8 54,51.46 T301.3 | T275.3 56.49,50.14 v57.15,50.8 57.81,51.46 T302.3 | T276.3 60.3,50.14 v60.96,50.8 61.62,51.46 T303.3 | T277.3 64.11,50.14 v64.77,50.8 | T225.3 64.11,41.88 v64.77,42.55 | T211.3 10.77,41.88 v11.43,42.55 12.09,43.2 T238.3 | T212.3 14.58,41.88 v15.24,42.55 15.9,43.2 T239.3 | T213.3 18.39,41.88 v19.05,42.55 19.71,43.2 T240.3 | T214.3 22.2,41.88 v22.86,42.55 23.52,43.2 T241.3 | T215.3 26.01,41.88 v26.67,42.55 27.33,43.2 T242.3 | T216.3 29.82,41.88 v30.48,42.55 31.14,43.2 T243.3 | T217.3 33.63,41.88 v34.29,42.55 34.95,43.2 T244.3 | T218.3 37.44,41.88 v38.1,42.55 38.76,43.2 T245.3 | T219.3 41.25,41.88 v41.91,42.55 42.57,43.2 T246.3 | T220.3 45.06,41.88 v45.72,42.55 46.38,43.2 T247.3
  Top 0.406: T221.3 48.87,41.88 v49.53,42.55 50.19,43.2 T248.3 | T222.3 52.68,41.88 v53.34,42.55 54,43.2 T249.3 | T223.3 56.49,41.88 v57.15,42.55 57.81,43.2 T250.3 | T224.3 60.3,41.88 v60.96,42.55 61.62,43.2 T251.3 | T313.3 6.96,58.4 v7.62,59.05 8.28,59.72 T341.3 | T365.3 6.96,66.65 v7.62,67.31 8.28,67.97 T393.3 | T367.3 10.77,66.65 v11.43,67.31 12.09,67.97 T394.3 | T368.3 14.58,66.65 v15.24,67.31 15.9,67.97 T395.3 | T369.3 18.39,66.65 v19.05,67.31 19.71,67.97 T396.3 | T315.3 10.77,58.4 v11.43,59.05 12.09,59.72 T342.3 | T316.3 14.58,58.4 v15.24,59.05 15.9,59.72 T343.3 | T317.3 18.39,58.4 v19.05,59.05 19.71,59.72 T344.3 | T318.3 22.2,58.4 v22.86,59.05 23.52,59.72 T345.3 | T319.3 26.01,58.4 v26.67,59.05 27.33,59.72 T346.3 | T320.3 29.82,58.4 v30.48,59.05 31.14,59.72 T347.3 | T321.3 33.63,58.4 v34.29,59.05 34.95,59.72 T348.3 | T370.3 22.2,66.65 v22.86,67.31 23.52,67.97 T397.3 | T371.3 26.01,66.65 v26.67,67.31 27.33,67.97 T398.3 | T372.3 29.82,66.65 v30.48,67.31 31.14,67.97 T399.3 | T373.3 33.63,66.65 v34.29,67.31 34.95,67.97 T400.3 | T374.3 37.44,66.65 v38.1,67.31 38.76,67.97 T401.3 | T375.3 41.25,66.65 v41.91,67.31 42.57,67.97 T402.3 | T376.3 45.06,66.65 v45.72,67.31 46.38,67.97 T403.3 | T377.3 48.87,66.65 v49.53,67.31 50.19,67.97 T404.3 | T378.3 52.68,66.65 v53.34,67.31 54,67.97 T405.3 | T379.3 56.49,66.65 v57.15,67.31 57.81,67.97 T406.3 | T380.3 60.3,66.65 v60.96,67.31 61.62,67.97 T407.3 | T381.3 64.11,66.65 v64.77,67.31 | T322.3 37.44,58.4 v38.1,59.05 38.76,59.72 T349.3 | T323.3 41.25,58.4 v41.91,59.05 42.57,59.72 T350.3 | T324.3 45.06,58.4 v45.72,59.05 46.38,59.72 T351.3 | T325.3 48.87,58.4 v49.53,59.05 50.19,59.72 T352.3
  Top 0.406: T326.3 52.68,58.4 v53.34,59.05 54,59.72 T353.3 | T327.3 56.49,58.4 v57.15,59.05 57.81,59.72 T354.3 | T328.3 60.3,58.4 v60.96,59.05 61.62,59.72 T355.3 | T329.3 64.11,58.4 v64.77,59.05
  Top 0.813: C2.1 64.77,12.06 v64.77,9.53 67.94,9.53 C1.1 | C4.1 64.77,20.32 v64.77,17.78 67.94,17.78 C3.1 | C6.1 64.77,28.57 v64.77,26.04 67.94,26.04 C5.1 | C8.1 64.77,36.83 v64.77,34.29 67.94,34.29 C7.1 | C10.1 64.77,45.09 v64.77,42.55 67.94,42.55 C9.1 | C12.1 64.77,53.34 v64.77,50.8 67.94,50.8 C11.1 | C14.1 64.77,61.59 v64.77,59.05 67.94,59.05 C13.1 | C16.1 64.77,69.85 v64.77,67.31 67.94,67.31 C15.1
  Top 1.27: 2.54,9.53 v3.81,9.53 | 2.54,9.53 1.27,9.53 1.27,17.78 | 1.27,17.78 v3.81,17.78 | 1.27,17.78 1.27,26.04 | 1.27,26.04 v3.81,26.04 | 1.27,26.04 1.27,34.29 | 1.27,34.29 v3.81,34.29 | 1.27,34.29 1.27,42.55 | 1.27,42.55 v3.81,42.55 | 1.27,42.55 1.27,50.8 | 1.27,50.8 v3.81,50.8 | 1.27,50.8 1.27,59.05 | 1.27,59.05 v3.81,59.05 | 1.27,59.05 1.27,67.31 v3.81,67.31 | 2.54,9.53 v2.54,4.13 4.76,1.91 v5.08,1.91 v7.62,1.91 8.26,1.27 v10.16,1.27
  Bottom 0.813: 1.27,67.31 1.27,72.39 v3.81,74.93 6.67,77.79 109.22,77.79 v112.08,74.93
  Bottom 1.27: v64.77,9.53 v60.96,9.53 v57.15,9.53 v53.34,9.53 v49.53,9.53 v45.72,9.53 v41.91,9.53 v38.1,9.53 v34.29,9.53 v30.48,9.53 v26.67,9.53 v22.86,9.53 v19.05,9.53 v15.24,9.53 v11.43,9.53 v7.62,9.53 v3.81,9.53 2.54,9.53 | 2.54,9.53 1.27,9.53 1.27,17.78 | 1.27,17.78 v3.81,17.78 v7.62,17.78 v11.43,17.78 v15.24,17.78 v19.05,17.78 v22.86,17.78 v26.67,17.78 v30.48,17.78 v34.29,17.78 v38.1,17.78 v41.91,17.78 v45.72,17.78 v49.53,17.78 v53.34,17.78 v57.15,17.78 v60.96,17.78 v64.77,17.78 | 1.27,17.78 1.27,26.04 | 1.27,26.04 v3.81,26.04 v7.62,26.04 v11.43,26.04 v15.24,26.04 v19.05,26.04 v22.86,26.04 v26.67,26.04 v30.48,26.04 v34.29,26.04 v38.1,26.04 v41.91,26.04 v45.72,26.04 v49.53,26.04 v53.34,26.04 v57.15,26.04 v60.96,26.04 v64.77,26.04 | 1.27,26.04 1.27,34.29 | 1.27,34.29 v3.81,34.29 v7.62,34.29 v11.43,34.29 v15.24,34.29 v19.05,34.29 v22.86,34.29 v26.67,34.29 v30.48,34.29 v34.29,34.29 v38.1,34.29 v41.91,34.29 v45.72,34.29 v49.53,34.29 v53.34,34.29 v57.15,34.29 v60.96,34.29 v64.77,34.29 | 1.27,34.29 1.27,42.55 | 1.27,42.55 v3.81,42.55 v7.62,42.55 v11.43,42.55 v15.24,42.55 v19.05,42.55 v22.86,42.55 v26.67,42.55 v30.48,42.55 v34.29,42.55 v38.1,42.55 v41.91,42.55 v45.72,42.55 v49.53,42.55 v53.34,42.55 v57.15,42.55 v60.96,42.55 v64.77,42.55 | 1.27,42.55 1.27,50.8 | 1.27,50.8 v3.81,50.8 v7.62,50.8 v11.43,50.8 v15.24,50.8 v19.05,50.8 v22.86,50.8 v26.67,50.8 v30.48,50.8 v34.29,50.8 v38.1,50.8 v41.91,50.8 v45.72,50.8 v49.53,50.8 v53.34,50.8 v57.15,50.8 v60.96,50.8 v64.77,50.8 | 1.27,50.8 1.27,59.05 | 1.27,59.05 1.27,67.31 v3.81,67.31 v7.62,67.31 v11.43,67.31 v15.24,67.31 v19.05,67.31 v22.86,67.31 v26.67,67.31 v30.48,67.31 v34.29,67.31 v38.1,67.31 v41.91,67.31 v45.72,67.31 v49.53,67.31 v53.34,67.31 v57.15,67.31 v60.96,67.31 v64.77,67.31
  Bottom 1.27: 1.27,59.05 v3.81,59.05 v7.62,59.05 v11.43,59.05 v15.24,59.05 v19.05,59.05 v22.86,59.05 v26.67,59.05 v30.48,59.05 v34.29,59.05 v38.1,59.05 v41.91,59.05 v45.72,59.05 v49.53,59.05 v53.34,59.05 v57.15,59.05 v60.96,59.05 v64.77,59.05 | v2.54,4.13 2.54,0.95 | v2.54,4.13 2.54,9.53 | 5.08,4.13 v5.08,1.91 5.08,0.95 | v2.54,4.13 5.08,4.13 | 7.62,4.13 v7.62,1.91 7.62,0.95 | 5.08,4.13 7.62,4.13 | 10.16,4.13 v10.16,1.27 10.16,0.95 | 7.62,4.13 10.16,4.13 | 12.7,0.95 12.7,4.13 10.16,4.13
  pour Bottom (isolate 0.356): 0.32,0.64 0.32,78.42 115.57,78.42 115.57,72.07 2.86,72.07 1.91,71.12 1.91,69.22 3.81,67.31 4.76,67.31 4.76,63.82 2.86,63.82 1.91,62.87 1.91,60.96 3.81,59.05 4.76,59.05 4.76,55.56 2.86,55.56 1.91,54.61 1.91,52.7 3.81,50.8 4.76,50.8 4.76,47.31 2.86,47.31 1.91,46.35 1.91,44.45 3.81,42.55 4.76,42.55 4.76,39.05 2.86,39.05 1.91,38.1 1.91,36.2 3.81,34.29 4.76,34.29 4.76,30.8 2.86,30.8 1.91,29.84 1.91,27.94 3.81,26.04 4.76,26.04 4.76,22.54 2.86,22.54 1.91,21.59 1.91,19.68 3.81,17.78 4.76,17.78 4.76,14.29 2.86,14.29 1.91,13.34 1.91,11.43 3.81,9.53 4.76,9.53 4.76,4.13 2.54,4.13 2.54,0.64
  pour Top (isolate 0.356): 0.32,0.64 0.32,78.42 62.23,78.42 62.23,72.07 2.86,72.07 1.91,71.12 1.91,69.22 4.45,66.67 4.45,63.82 2.86,63.82 1.91,62.87 1.91,60.96 4.45,58.42 4.45,55.56 2.86,55.56 1.91,54.61 1.91,52.7 4.45,50.16 4.45,47.31 2.86,47.31 1.91,46.35 1.91,44.45 4.45,41.91 4.45,39.05 2.86,39.05 1.91,38.1 1.91,36.2 4.45,33.66 4.45,30.8 2.86,30.8 1.91,29.84 1.91,27.94 4.45,25.4 4.45,22.54 2.86,22.54 1.91,21.59 1.91,19.68 4.45,17.14 4.45,14.29 2.86,14.29 1.91,13.34 1.91,11.43 4.45,8.89 4.45,4.45 5.71,3.17 8.26,3.17 9.53,1.91 10.79,1.91 12.06,0.64
  pour Top (isolate 0.356): 71.12,78.42 71.12,72.07 115.25,72.07 115.25,78.42
I0  (via drill 0.61 pad 1.02)